# EAGLE design simple_rat (EAGLE 9.6.2)
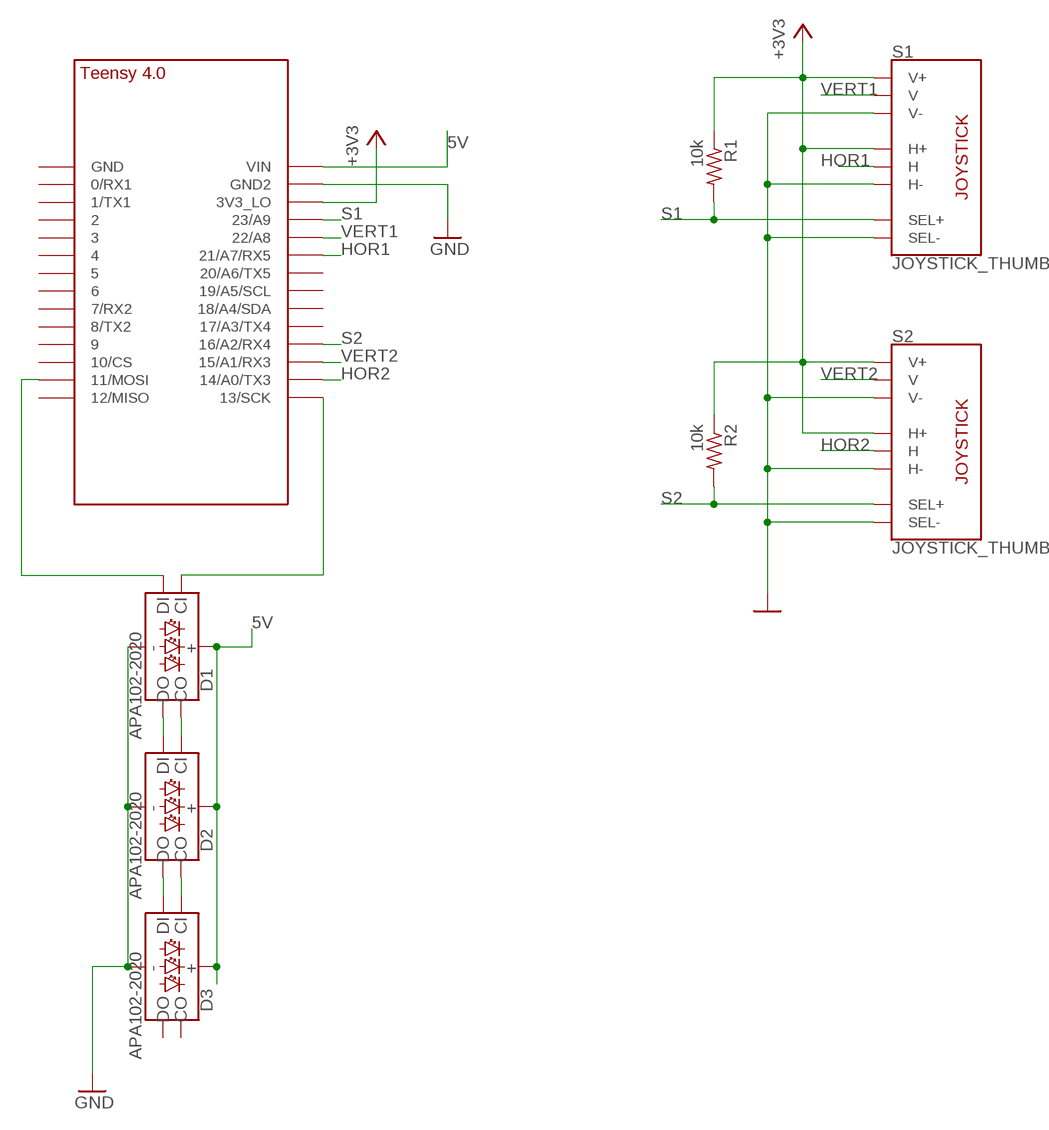
[diagram p0: schematic, sheet 1]

## Parts
D1  APA102-2020  [APA102-2020]
D2  APA102-2020  [APA102-2020]
D3  APA102-2020  [APA102-2020]
MCU  TEENSY_4.0-NOBOTTOM  [TEENSY_4.0-NOBOTTOM]
R1  10k  R-US_R0603  [R0603]
R2  10k  R-US_R0603  [R0603]
S1  JOYSTICK_THUMB  [JOYSTICK]
S2  JOYSTICK_THUMB  [JOYSTICK]

## Nets
5V: D1.5V_VIA(VCC) D1.VDD(VCC) D2.5V_VIA(VCC) D2.VDD(VCC) D3.5V_VIA(VCC) D3.VDD(VCC) MCU.VIN
+3V3: MCU.3V3_LO R1.1 R2.1 S1.H1(H+) S1.V1(V+) S2.H1(H+) S2.V1(V+)
GND: D1.GND D1.GND_VIA(GND) D2.GND D2.GND_VIA(GND) D3.GND D3.GND_VIA(GND) MCU.GND2 S1.B2A(SEL-) S1.H3(H-) S1.V3(V-) S2.B2A(SEL-) S2.H3(H-) S2.V3(V-)
HOR1: MCU.21/A7(21/A7/RX5) S1.H2(H)
HOR2: MCU.14/A0(14/A0/TX3) S2.H2(H)
N$8: D1.SDO(DO) D2.SDI(DI)
N$9: D1.CKO(CO) D2.CKI(CI)
N$10: D2.SDO(DO) D3.SDI(DI)
N$11: D2.CKO(CO) D3.CKI(CI)
N$12: D1.CKI(CI) MCU.13/SCK
N$13: D1.SDI(DI) MCU.11/MOSI
S1: MCU.23/A9 R1.2 S1.B1A(SEL+)
S2: MCU.16/A2(16/A2/RX4) R2.2 S2.B1A(SEL+)
VERT1: MCU.22/A8 S1.V2(V)
VERT2: MCU.15/A1(15/A1/RX3) S2.V2(V)
Unconnected: D3.CKO(CO) D3.SDO(DO) MCU.0/RX(0/RX1) MCU.1/TX(1/TX1) MCU.2 MCU.3/CANTX MCU.4/CANRX MCU.5 MCU.6 MCU.7(7/RX2) MCU.8(8/TX2) MCU.9/CS MCU.10/CS MCU.12/MISO MCU.17/A3(17/A3/TX4) MCU.18/A4/SDA MCU.19/A5/SCL MCU.20/A6(20/A6/TX5) MCU.GND

## Library data of the parts
D1-D3 = custom:APA102: Addressable RGB LED - 2 Wire Common names: APA102, Dotstar, etc. Packages: 5050 2020 SparkFun Products: SparkFun Lumenati Boards <https://www.sparkfun.com/categories/405>; PROD_ID: DIO-14111
MCU = Teensy-4.0:TEENSY_4.0-NOBOTTOM
R1 R2 = adafruit:R-US_: RESISTOR, American symbol
S1 S2 = SparkFun-Switches:JOYSTICK_THUMB: Analog Thumb Joystick This is a joystick very similar to the ‘analog’ joysticks on PS2 (PlayStation 2) controllers. Directional movements are simply two potentiometers - one for each axis. Pots are ~10k each. This joystick also has a select button that is actuated when the joystick is pressed down. SparkFun Products Thumb Joystick <https://www.sparkfun.com/products/9032> (COM-09032) SparkFun Thumb Joystick Breakout <https://www.sparkfun.com/products/9110> (BOB-09110) SparkFun Joystick Shield Kit <https://www.sparkfun.com/products/9760> (DEV-09760); PROD_ID: COMP-09744; SF_SKU: COM-09032

## Net classes
0 default: width 0.127 mm

## Board
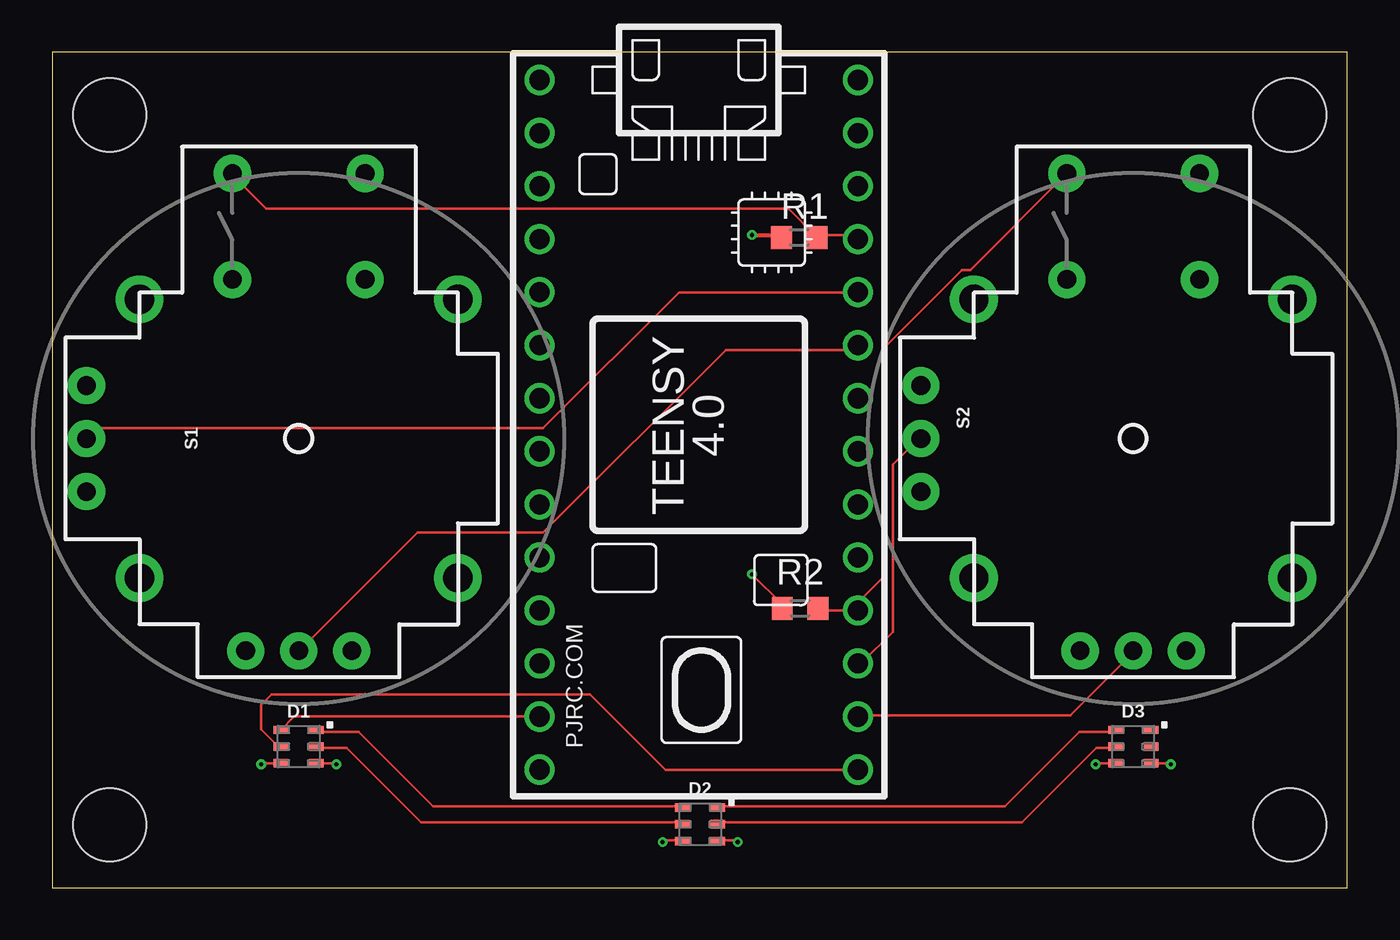
[diagram p1: board, top side]
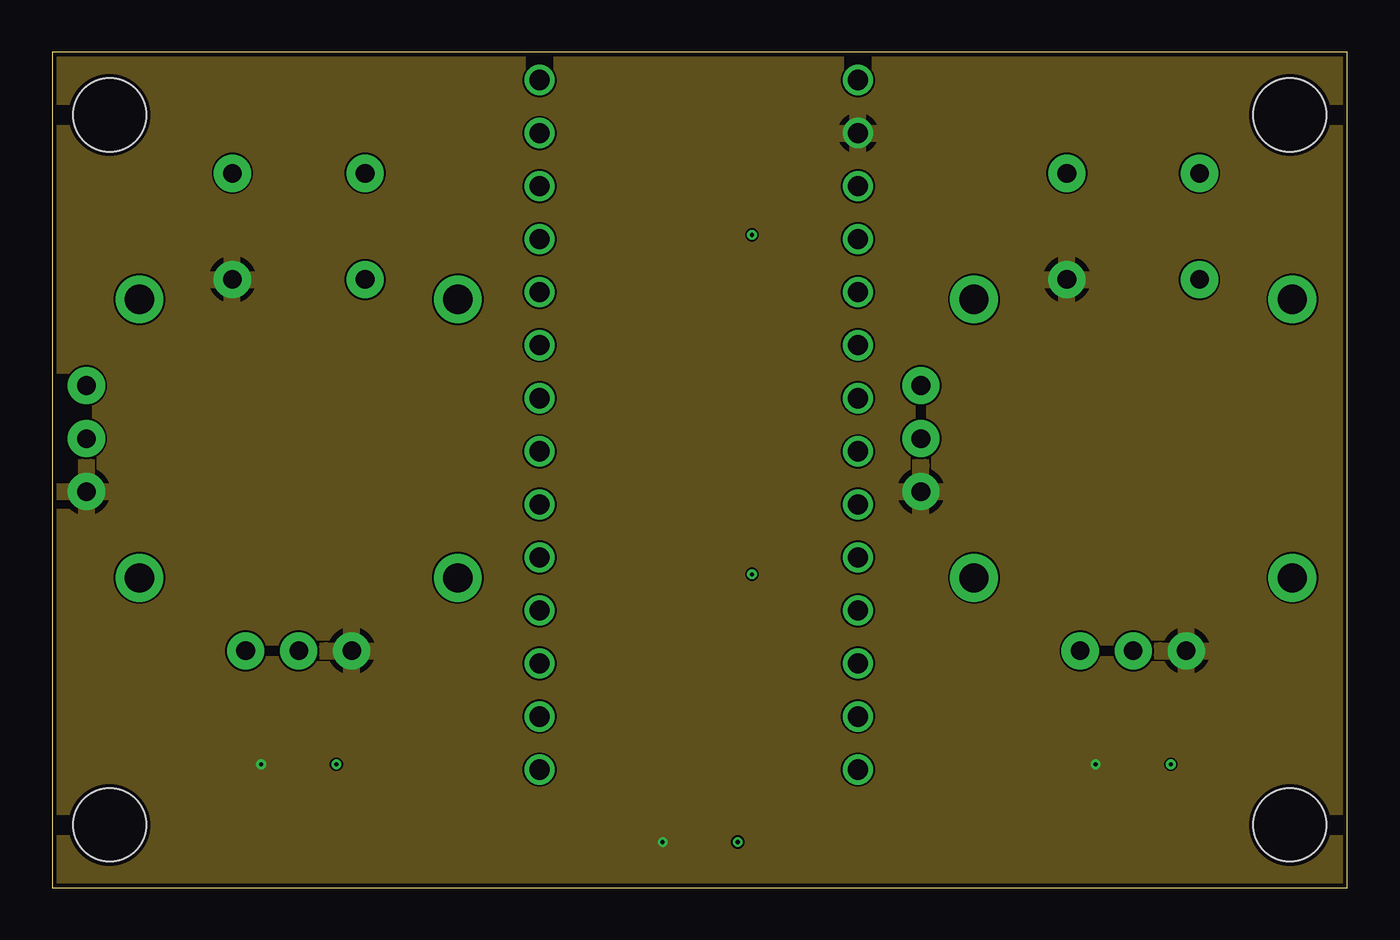
[diagram p2: board, inner layer Route2]
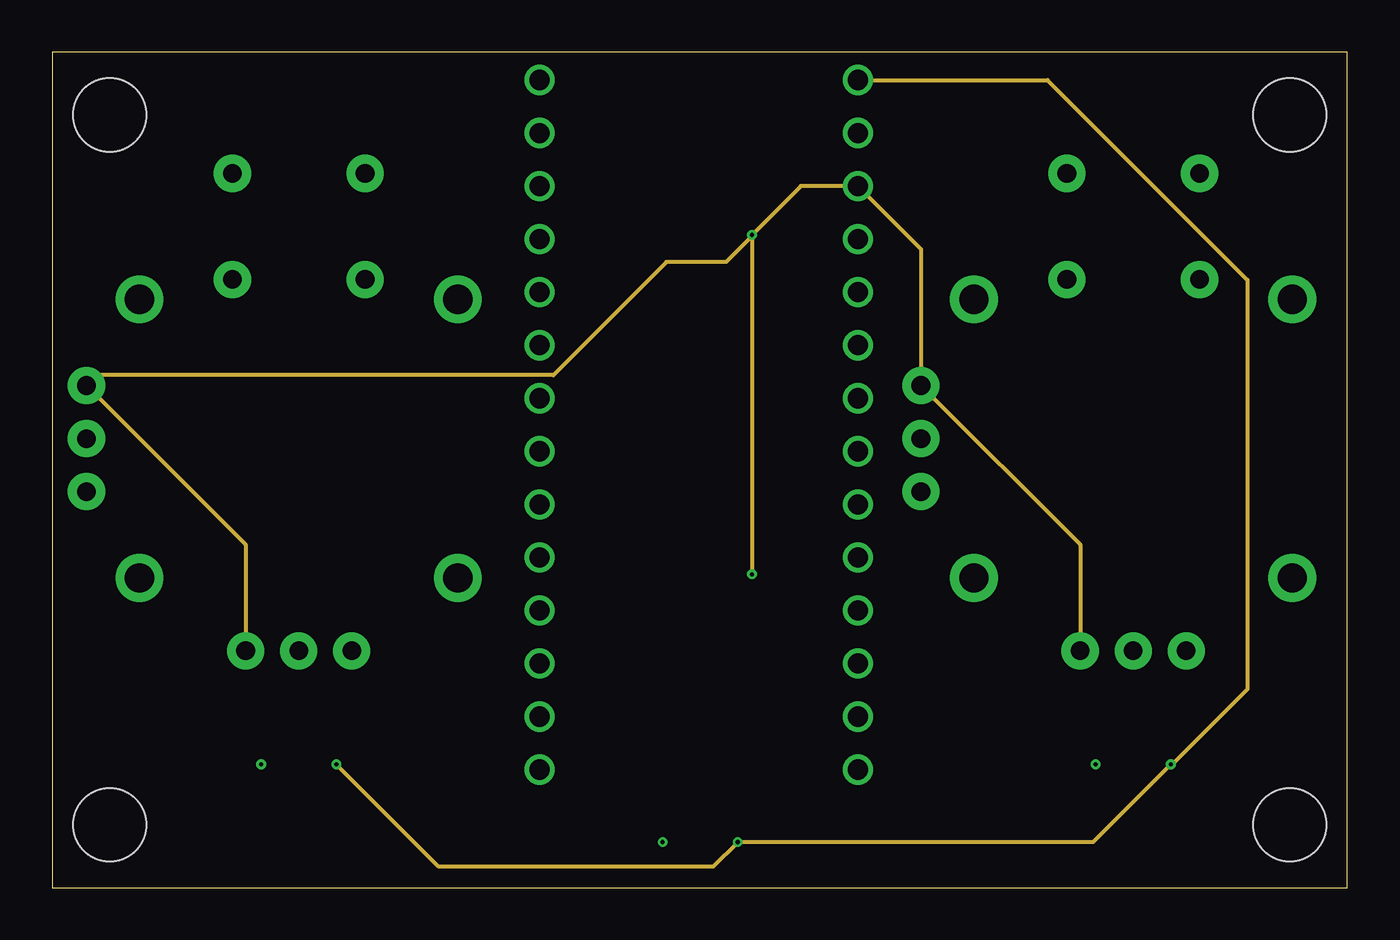
[diagram p3: board, inner layer Route15]
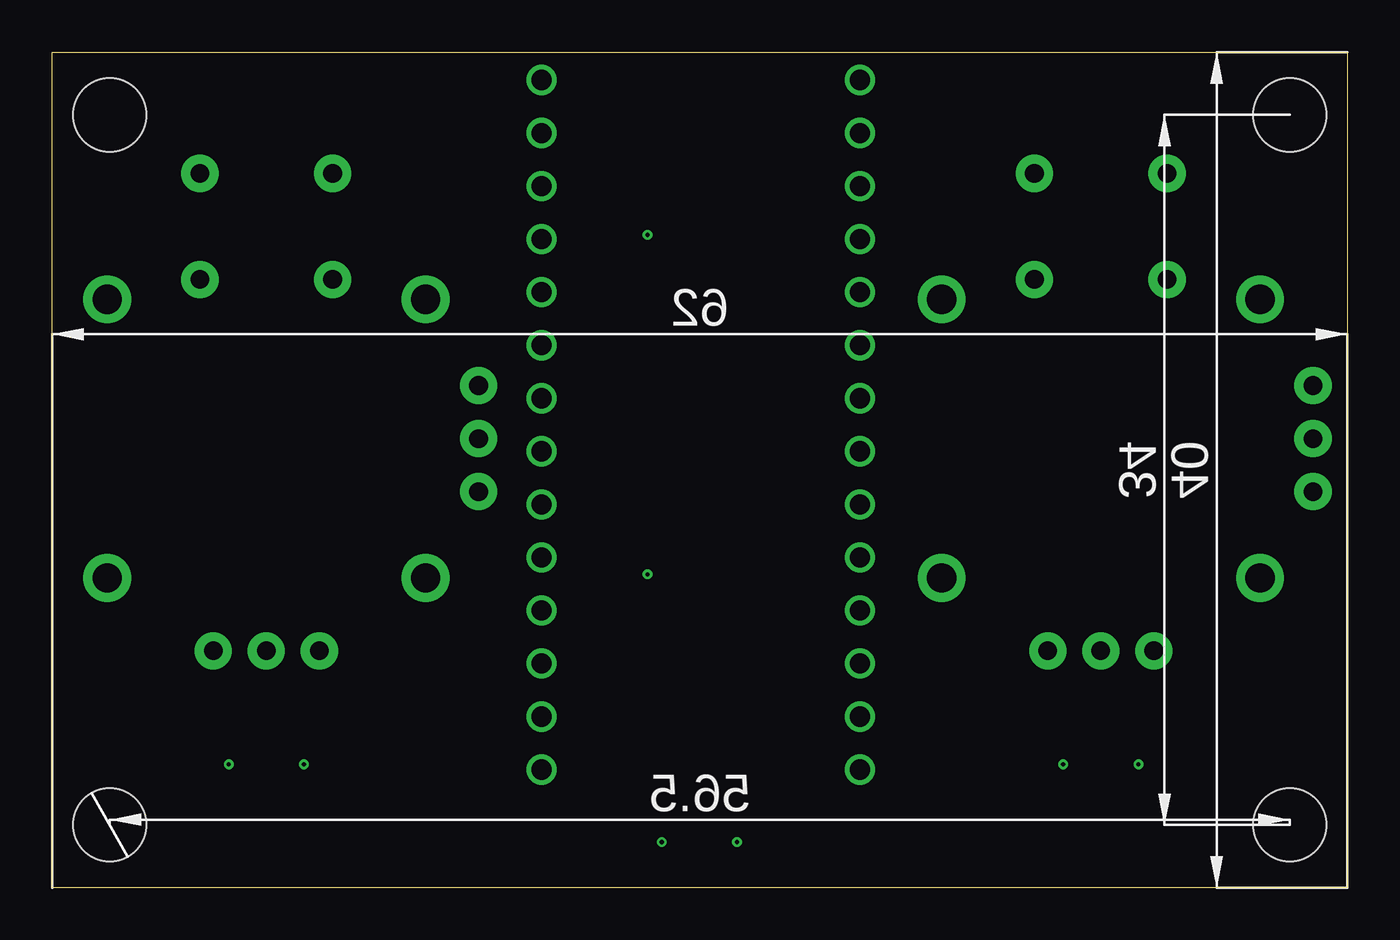
[diagram p4: board, bottom side, seen from below]

Size 62 x 40 mm. Coordinates in mm from the lower left corner, seen from the top.
Outline: 0,0 62,0 62,40 0,40 0,0
Copper layers (1+2*15+16): Top 0.035mm / dielectric 0.2mm / Route2 0.035mm / dielectric 0.15mm / Route15 0.035mm / dielectric 0.2mm / Bottom 0.035mm
Design rules "jlcpcb": minimum track width 3.5mil, minimum drill 0.2mm, track to track 3.5mil, track to pad 0.2mm, pad to pad 5mil, via to via 10mil, smd to smd 5mil, copper to edge 0.2mm, drill to drill 0.5mm, minimum pad ring 0.13mm, minimum via ring 0.13mm, stop-mask expansion 4mil, vias tented up to drill 0mil, thermal gap 10mil
Holes 3.5 mm at 2.75,3 2.75,37 59.25,37 59.25,3

### Footprints (pad centres in the part's own frame; a part is rotated, then mirrored left to right if it is on the bottom)
APA102-2020 = drill 0.2: 5V_VIA 1.8,-0.6; GND_VIA -1.8,-0.6 | smd 0.7 x 0.4: CKI -0.85,0.254; CKO 0.85,0.254; GND -0.85,-0.546; SDI -0.85,1.054; SDO 0.85,1.054; VDD 0.85,-0.546
TEENSY_4.0-NOBOTTOM = drill 0.965: 0/RX -13.97,-7.62; 1/TX -11.43,-7.62; 2 -8.89,-7.62; 3/CANTX -6.35,-7.62; 3V3_LO -11.43,7.62; 4/CANRX -3.81,-7.62; 5 -1.27,-7.62; 6 1.27,-7.62; 7 3.81,-7.62; 8 6.35,-7.62; 9/CS 8.89,-7.62; 10/CS 11.43,-7.62; 11/MOSI 13.97,-7.62; 12/MISO 16.51,-7.62; 13/SCK 16.51,7.62; 14/A0 13.97,7.62; 15/A1 11.43,7.62; 16/A2 8.89,7.62; 17/A3 6.35,7.62; 18/A4/SDA 3.81,7.62; 19/A5/SCL 1.27,7.62; 20/A6 -1.27,7.62; 21/A7 -3.81,7.62; 22/A8 -6.35,7.62; 23/A9 -8.89,7.62; GND -16.51,-7.62; GND2 -13.97,7.62; VIN -16.51,7.62
R0603 = smd 1 x 1.1: 1 -0.85,0; 2 0.85,0
JOYSTICK = drill 0.9 pad 1.778: B1A -3.175,12.7; B1B 3.175,12.7; B2A -3.175,7.62; B2B 3.175,7.62 | drill 0.889 pad 1.778: H1 -2.54,-10.16; H2 0,-10.16; H3 2.54,-10.16; V1 -10.16,2.54; V2 -10.16,0; V3 -10.16,-2.54 | drill 1.397 pad 2.286: MOUNT1 -7.62,6.668; MOUNT2 -7.62,-6.668; MOUNT3 7.62,-6.668; MOUNT4 7.62,6.668

### Placement (x,y rotation side)
D1  11.8,6.5 0 top
D2  31.02,2.78 0 top
D3  51.75,6.5 0 top
MCU  30.95,22.16 270 top
R1  35.77,31.13 0 top
R2  35.8,13.37 0 top
S1  11.8,21.5 0 top
S2  51.75,21.5 0 top

### Tracks (layer width: path | path; a pad name or v marks a point on that pad's centre or on a via)
5V
  Top 0.127: D1.VDD 12.74,5.94 13.49,5.94 D1.5V_VIA | D2.VDD 31.95,2.27 32.82,2.27 D2.5V_VIA | D3.VDD 52.68,5.94 53.54,5.94 D3.5V_VIA
  Route15 0.2: MCU.VIN 47.65,38.67 57.22,29.1 57.22,10.25 57.22,10.22 57.22,9.5 53.62,5.9 D3.5V_VIA 49.83,2.18 D2.5V_VIA 31.64,1 18.5,1 D1.5V_VIA
+3V3  (via drill 0.2)
  Top 0.127: v33.5,15 34.95,13.55 R2.1
  Top 0.2: v33.5,31.25 34.8,31.25 R1.1
  Route15 0.2: S2.H1 49.21,16.42 S2.V1 41.59,30.57 MCU.3V3_LO 35.84,33.59 v33.5,31.25 | S1.H1 9.26,16.42 S1.V1 2.14,24.54 23.99,24.54 29.41,29.95 32.25,29.95 33.5,31.2 v33.5,31.25 | v33.5,31.25 v33.5,15
GND
  Top 0.127: D1.GND 10.9,5.94 10.04,5.94 D1.GND_VIA | D2.GND 30.12,2.27 29.25,2.27 D2.GND_VIA | D3.GND 50.84,5.94 49.98,5.94 D3.GND_VIA
  pour Route2: 0,40 0,0 62,0 62,40
HOR1
  Top 0.127: MCU.21/A7 38.5,25.75 32.25,25.75 23.5,17 17.5,17 12,11.5 S1.H2
HOR2
  Top 0.127: MCU.14/A0 38.75,8.25 48.75,8.25 51.75,11.25 S2.H2
N$8
  Top 0.127: D2.SDI 30.12,3.89 18.23,3.89 14.67,7.45 12.74,7.45 D1.SDO
N$9
  Top 0.127: D2.CKI 30.12,3.13 17.66,3.13 14.1,6.69 12.74,6.69 D1.CKO
N$10
  Top 0.127: D2.SDO 31.95,3.89 45.6,3.89 49.16,7.45 50.84,7.45 D3.SDI
N$11
  Top 0.127: D2.CKO 31.95,3.13 46.42,3.13 49.98,6.69 50.84,6.69 D3.CKI
N$12
  Top 0.127: MCU.13/SCK 29.35,5.65 25.75,9.25 10.5,9.25 10,8.75 10,7.58 10.83,6.75 D1.CKI
N$13
  Top 0.127: MCU.11/MOSI 11.59,8.19 D1.SDI
S1
  Top 0.127: MCU.23/A9 38.5,31.25 36.75,31.25 R1.2 35.25,32.5 10.25,32.5 8.75,34 S1.B1A
S2
  Top 0.127: S2.B1A 43.95,29.57 43.55,29.57 39.81,25.83 39.81,14.9 38.57,13.66 MCU.16/A2 36.75,13.27 R2.2
VERT1
  Top 0.127: MCU.22/A8 38.5,28.5 30,28.5 23.5,22 2.25,22 1.75,21.5 S1.V2
VERT2
  Top 0.127: MCU.15/A1 38.75,10.75 40.25,12.25 40.25,20.25 41.5,21.5 S2.V2